# Altium schematic sheet Sheet1.SchDoc
size A
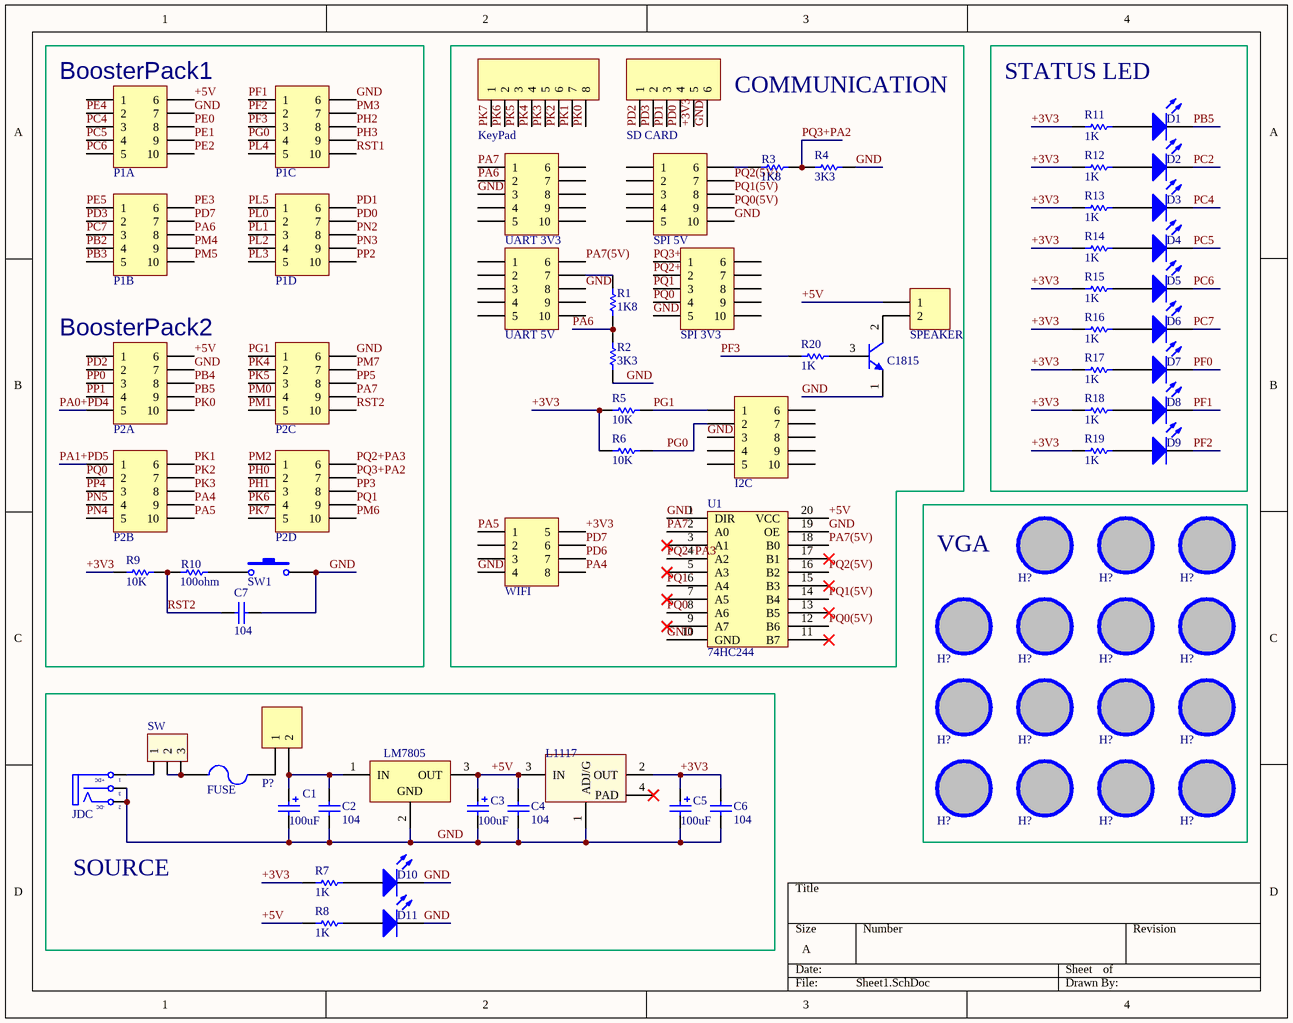
[diagram p0: Sheet1.SchDoc]

## Parts
(Parts that share a designator on the sheet are numbered #1, #2 ... from top to bottom, then left to right.)
C1  value 100uF  [CP1/2]  (hidden comment: Cap Pol)
C2  value 104  [CN1]  (hidden comment: Cap Non-Pol)
C3  value 100uF  [CP1/2]  (hidden comment: Cap Pol)
C4  value 104  [CN1]  (hidden comment: Cap Non-Pol)
C5  value 100uF  [CP1/2]  (hidden comment: Cap Pol)
C6  value 104  [CN1]  (hidden comment: Cap Non-Pol)
C7  value 104  [CN1]  (hidden comment: Cap Non-Pol)
D1  LED  [LED-3mm]  (value not drawn)
D2  LED  [LED-3mm]  (value not drawn)
D3  LED  [LED-3mm]  (value not drawn)
D4  LED  [LED-3mm]  (value not drawn)
D5  LED  [LED-3mm]  (value not drawn)
D6  LED  [LED-3mm]  (value not drawn)
D7  LED  [LED-3mm]  (value not drawn)
D8  LED  [LED-3mm]  (value not drawn)
D9  LED  [LED-3mm]  (value not drawn)
D10  LED  [LED-3mm]  (value not drawn)
D11  LED  [LED-3mm]  (value not drawn)
FUSE  Fuse  [FUSE]  (value not drawn)
H?#1  Hole  [LO KHOAN 3MM]  (value not drawn)
H?#2  Hole  [LO KHOAN 3MM]  (value not drawn)
H?#3  Hole  [LO KHOAN 3MM]  (value not drawn)
H?#4  Hole  [LO KHOAN 3MM]  (value not drawn)
H?#5  Hole  [LO KHOAN 3MM]  (value not drawn)
H?#6  Hole  [LO KHOAN 3MM]  (value not drawn)
H?#7  Hole  [LO KHOAN 3MM]  (value not drawn)
H?#8  Hole  [LO KHOAN 3MM]  (value not drawn)
H?#9  Hole  [LO KHOAN 3MM]  (value not drawn)
H?#10  Hole  [LO KHOAN 3MM]  (value not drawn)
H?#11  Hole  [LO KHOAN 3MM]  (value not drawn)
H?#12  Hole  [LO KHOAN 3MM]  (value not drawn)
H?#13  Hole  [LO KHOAN 3MM]  (value not drawn)
H?#14  Hole  [LO KHOAN 3MM]  (value not drawn)
H?#15  Hole  [LO KHOAN 3MM]  (value not drawn)
I2C  Header 5X2  [JP5X2]  (value not drawn)
JDC  Jack DC  [DC-IN]  (value not drawn)
KeyPad  Header 8  [JP8]  (value not drawn)
L1117  LM1117  [SOT223-4N]  (value not drawn)
LM7805  LM7805  [QTO-220]  (value not drawn)
P1A  Header 5X2  [JP5X2]  (value not drawn)
P1B  Header 5X2  [JP5X2]  (value not drawn)
P1C  Header 5X2  [JP5X2]  (value not drawn)
P1D  Header 5X2  [JP5X2]  (value not drawn)
P2A  Header 5X2  [JP5X2]  (value not drawn)
P2B  Header 5X2  [JP5X2]  (value not drawn)
P2C  Header 5X2  [JP5X2]  (value not drawn)
P2D  Header 5X2  [JP5X2]  (value not drawn)
P?  Header 2  [JP2]  (value not drawn)
Q0  C1815  [QTO-92]
R1  value 1K8  [RES 1/2W]  (hidden comment: RESISTOR)
R2  value 3K3  [RES 1/2W]  (hidden comment: RESISTOR)
R3  value 1K8  [RES 1/2W]  (hidden comment: RESISTOR)
R4  value 3K3  [RES 1/2W]  (hidden comment: RESISTOR)
R5  value 10K  [RES 1/2W]  (hidden comment: RESISTOR)
R6  value 10K  [RES 1/2W]  (hidden comment: RESISTOR)
R7  value 1K  [RES 1/2W]  (hidden comment: RESISTOR)
R8  value 1K  [RES 1/2W]  (hidden comment: RESISTOR)
R9  value 10K  [RES 1/2W]  (hidden comment: RESISTOR)
R10  value 100ohm  [RES 1/2W]  (hidden comment: RESISTOR)
R11  value 1K  [RES 1/2W]  (hidden comment: RESISTOR)
R12  value 1K  [RES 1/2W]  (hidden comment: RESISTOR)
R13  value 1K  [RES 1/2W]  (hidden comment: RESISTOR)
R14  value 1K  [RES 1/2W]  (hidden comment: RESISTOR)
R15  value 1K  [RES 1/2W]  (hidden comment: RESISTOR)
R16  value 1K  [RES 1/2W]  (hidden comment: RESISTOR)
R17  value 1K  [RES 1/2W]  (hidden comment: RESISTOR)
R18  value 1K  [RES 1/2W]  (hidden comment: RESISTOR)
R19  value 1K  [RES 1/2W]  (hidden comment: RESISTOR)
R20  value 1K  [RES 1/2W]  (hidden comment: RESISTOR)
SD_CARD  Header 6  [JP6]  (value not drawn)
SPEAKER  Domino 2  [DOMINO 2- 5mm]  (value not drawn)
SPI_3V3  Header 5X2  [JP5X2]  (value not drawn)
SPI_5V  Header 5X2  [JP5X2]  (value not drawn)
SW  (no value)  [HED3]
SW1  Tact SW - 2Pin  [SW2]  (value not drawn)
U1  74HC244  [DIP20/W0.3]
UART_3V3  Header 5X2  [JP5X2]  (value not drawn)
UART_5V  Header 5X2  [JP5X2]  (value not drawn)
WIFI  Header 4X2  [JP4x2]  (value not drawn)

## Blocks framed on the sheet
COMMUNICATION: I2C KeyPad Q0 R1-R6 R20 SD_CARD SPEAKER SPI_3V3 SPI_5V U1 UART_3V3 UART_5V WIFI
STATUS LED: D1-D9 R11-R19
VGA: H?#1-H?#15
SOURCE: C1-C6 D10 D11 FUSE JDC L1117 LM7805 P? R7 R8 SW

## Nets
+3V3: C5.1 C6.2 L1117.2(OUT) R5.1 R6.1 R7.1 R9.1 R11.1 R12.1 R13.1 R14.1 R15.1 R16.1 R17.1 R18.1 R19.1 SD_CARD.5 WIFI.5
+5V: C3.1 C4.2 L1117.3(IN) LM7805.3(OUT) P1A.6 P2A.6 R8.1 SPEAKER.1 U1.20(VCC)
GND: C1.2 C2.1 C3.2 C4.1 C5.2 C6.1 C7.2 D10.2(K) D11.2(K) I2C.3 JDC.2(TN) JDC.3(S) L1117.1(ADJ/G) LM7805.2(GND) P1A.7 P1C.6 P2A.7 P2C.6 Q0.1(E) R2.2 R4.2 SD_CARD.6 SPI_3V3.5 SPI_5V.10 SW1.2 U1.1(DIR) U1.10(GND) U1.19(OE) UART_3V3.3 UART_5V.8 WIFI.4
PA0+PD4: P2A.5
PA1+PD5: P2B.1
PA4: P2B.9 WIFI.8
PA5: P2B.10 WIFI.1
PA6: P1B.8 R1.1 R2.1 UART_3V3.2
PA7: P2C.9 U1.2(A0) UART_3V3.1
PA7(5V): U1.18(B0) UART_5V.6
PB2: P1B.4
PB3: P1B.5
PB4: P2A.8
PB5: D1.2(K) P2A.9
PC2: D2.2(K)
PC4: D3.2(K) P1A.3
PC5: D4.2(K) P1A.4
PC6: D5.2(K) P1A.5
PC7: D6.2(K) P1B.3
PD0: P1D.7 SD_CARD.4
PD1: P1D.6 SD_CARD.3
PD2: P2A.2 SD_CARD.1
PD3: P1B.2 SD_CARD.2
PD6: WIFI.7
PD7: P1B.7 WIFI.6
PE0: P1A.8
PE1: P1A.9
PE2: P1A.10
PE3: P1B.6
PE4: P1A.2
PE5: P1B.1
PF0: D7.2(K)
PF1: D8.2(K) P1C.1
PF2: D9.2(K) P1C.2
PF3: P1C.3 R20.1
PG0: I2C.2 P1C.4 R6.2
PG1: I2C.1 P2C.1 R5.2
PH0: P2D.2
PH1: P2D.3
PH2: P1C.8
PH3: P1C.9
PK0: KeyPad.8 P2A.10
PK1: KeyPad.7 P2B.6
PK2: KeyPad.6 P2B.7
PK3: KeyPad.5 P2B.8
PK4: KeyPad.4 P2C.2
PK5: KeyPad.3 P2C.3
PK6: KeyPad.2 P2D.4
PK7: KeyPad.1 P2D.5
PL0: P1D.2
PL1: P1D.3
PL2: P1D.4
PL3: P1D.5
PL4: P1C.5
PL5: P1D.1
PM0: P2C.4
PM1: P2C.5
PM2: P2D.1
PM3: P1C.7
PM4: P1B.9
PM5: P1B.10
PM6: P2D.10
PM7: P2C.7
PN2: P1D.8
PN3: P1D.9
PN4: P2B.5
PN5: P2B.4
PP0: P2A.3
PP1: P2A.4
PP2: P1D.10
PP3: P2D.8
PP4: P2B.3
PP5: P2C.8
PQ0: P2B.2 SPI_3V3.4 U1.8(A6)
PQ0(5V): SPI_5V.9 U1.12(B6)
PQ1: P2D.9 SPI_3V3.3 U1.6(A4)
PQ1(5V): SPI_5V.8 U1.14(B4)
PQ2(5V): SPI_5V.7 U1.16(B2)
PQ2+PA3: P2D.6 SPI_3V3.2 U1.4(A2)
PQ3+PA2: P2D.7 R3.2 R4.1 SPI_3V3.1
RST1: P1C.10
RST2: C7.1 P2C.10 R9.2 R10.1
NetC1_1: C1.1 C2.2 LM7805.1(IN) P?.2
NetD1_1: D1.1(A) R11.2
NetD2_1: D2.1(A) R12.2
NetD3_1: D3.1(A) R13.2
NetD4_1: D4.1(A) R14.2
NetD5_1: D5.1(A) R15.2
NetD6_1: D6.1(A) R16.2
NetD7_1: D7.1(A) R17.2
NetD8_1: D8.1(A) R18.2
NetD9_1: D9.1(A) R19.2
NetD10_1: D10.1(A) R7.2
NetD11_1: D11.1(A) R8.2
NetFUSE_1: FUSE.1 SW.2 SW.3
NetFUSE_2: FUSE.2 P?.1
NetJDC_1: JDC.1(T) SW.1
NetQ0_2: Q0.2(C) SPEAKER.2
NetQ0_3: Q0.3(B) R20.2
NetR1_2: R1.2 UART_5V.7
NetR3_1: R3.1 SPI_5V.6
NetR10_2: R10.2 SW1.1

Not connected (* = marked no-connect by the designer): H?#1 1; H?#2 1; H?#3 1; H?#4 1; H?#5 1; H?#6 1; H?#7 1; H?#8 1; H?#9 1; H?#10 1; H?#11 1; H?#12 1; H?#13 1; H?#14 1; H?#15 1; I2C 4 5 6 7 8 9 10; L1117 4(PAD)*; P1A 1; P2A 1; SPI_3V3 6 7 8 9 10; SPI_5V 1 2 3 4 5; U1 3(A1)* 5(A3)* 7(A5)* 9(A7)* 11(B7)* 13(B5)* 15(B3)* 17(B1)*; UART_3V3 4 5 6 7 8 9 10; UART_5V 1 2 3 4 5 9 10; WIFI 2 3

## Notes on the sheet
- (near P1A) BoosterPack1
- (near P2A) BoosterPack2
- (in symbol Jack DC) +DC; -DC

## Library data of the parts
C1 C3 C5 = Cap Pol: Polarized Capacitor (Radial)
C2 C4 C6 C7 = Cap Non-Pol: Capacitor
H?#1-H?#15 = Hole: Hole 3mm
I2C P1A P1B P1C P1D P2A P2B P2C P2D SPI_3V3 SPI_5V UART_3V3 UART_5V = Header 5X2: Header, 5-Pin, Dual row; LatestRevisionDate: 17-Jul-2002; LatestRevisionNote: Re-released for DXP Platform.; Publisher: Altium Limited
JDC = Jack DC: Jack DC input; Value: Jac DC
KeyPad = Header 8: Header, 8-Pin; LatestRevisionDate: 17-Jul-2002; LatestRevisionNote: Re-released for DXP Platform.; Publisher: Altium Limited
L1117 = LM1117: Available in 1.8V, 2.5V, 2.85V, 3.3V, 5V, and  Adjustable Versions; Value: LM317
LM7805 = LM7805: Positive Voltage Regulator
P? = Header 2: Header, 2-Pin; LatestRevisionDate: 17-Jul-2002; LatestRevisionNote: Re-released for DXP Platform.; Publisher: Altium Limited
Q0 = C1815: NPN Bipolar Transistor
SD_CARD = Header 6: Header, 6-Pin; LatestRevisionDate: 17-Jul-2002; LatestRevisionNote: Re-released for DXP Platform.; Publisher: Altium Limited
SPEAKER = Domino 2: Domino, 2-Pin; LatestRevisionDate: 17-Jul-2002; LatestRevisionNote: Re-released for DXP Platform.; Publisher: Altium Limited
SW = Hed3: Header 3 (Green); Value: Header 3
SW1 = Tact SW - 2Pin: Switch button 2 pin
U1 = 74HC245: Octal bus tranceiver
WIFI = Header 4X2: Header, 4-Pin, Dual row; LatestRevisionDate: 17-Jul-2002; LatestRevisionNote: Re-released for DXP Platform.; Publisher: Altium Limited